# Altium schematic sheet P02_MCU.SchDoc
size A4; SheetNumber: 2; SheetTotal: 3
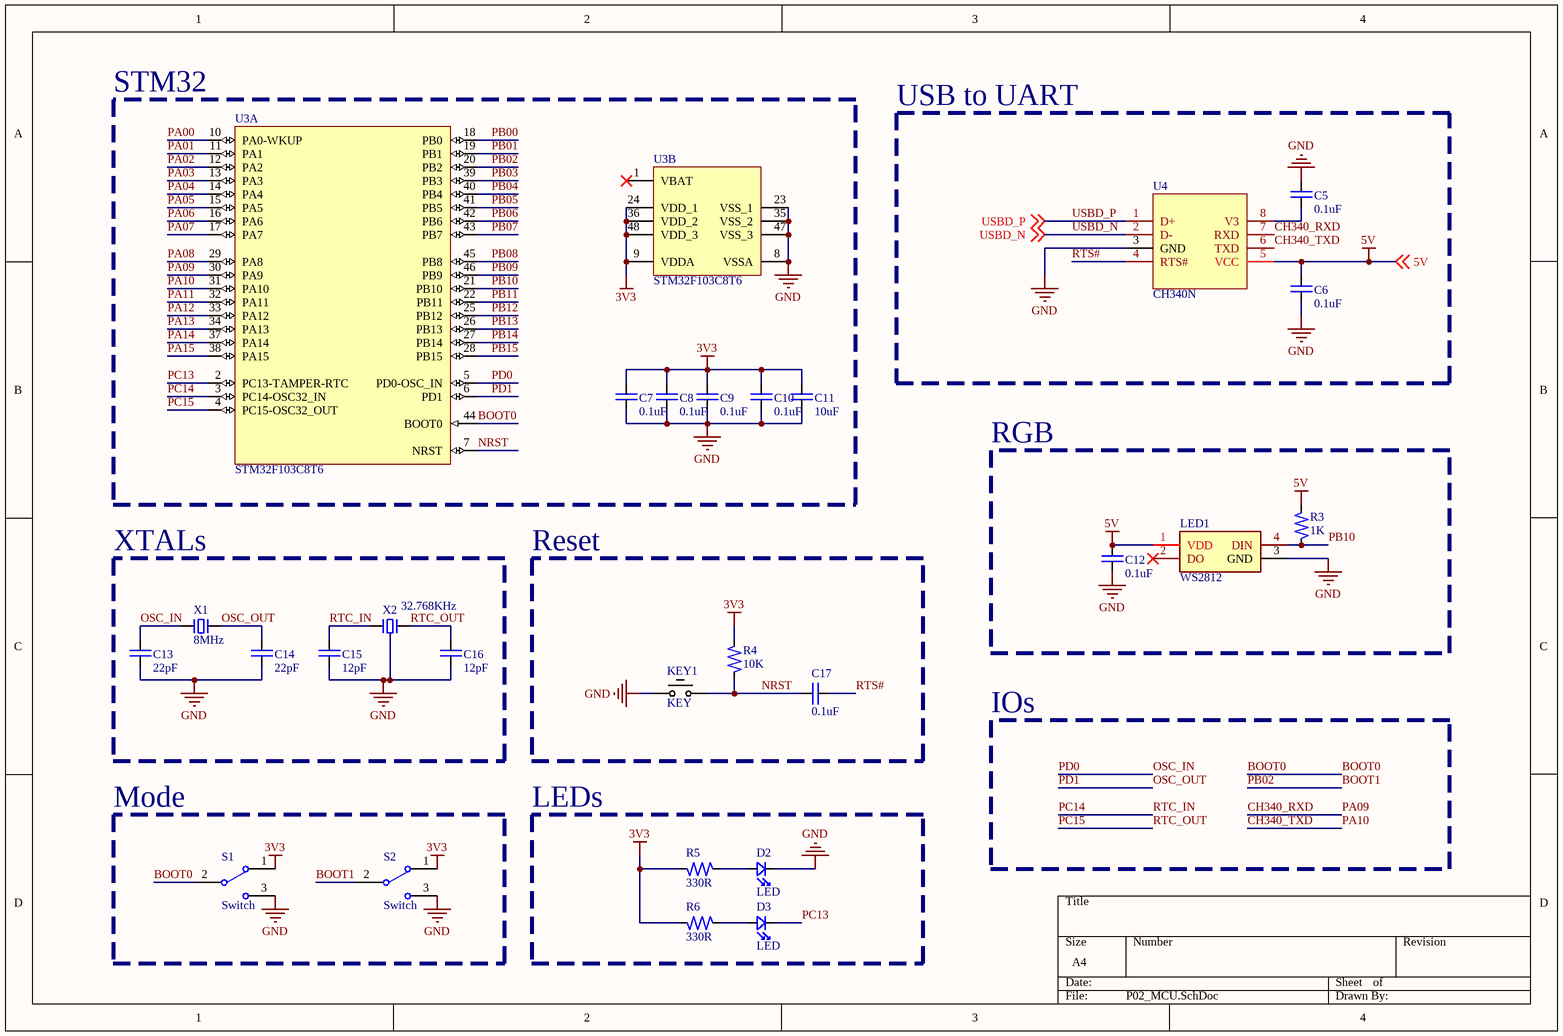
[diagram p0: P02_MCU.SchDoc]

## Parts
C5  0.1uF  [C_0603]
C6  0.1uF  [C_0603]
C7  0.1uF  [C_0603]
C8  0.1uF  [C_0603]
C9  0.1uF  [C_0603]
C10  0.1uF  [C_0603]
C11  10uF  [C_0603]
C12  0.1uF  [C_0603]
C13  22pF  [C_0603]
C14  22pF  [C_0603]
C15  12pF  [C_0603]
C16  12pF  [C_0603]
C17  0.1uF  [C_0603]
D2  LED  [LED_0603]
D3  LED  [LED_0603]
KEY1  KEY  [KEY]
LED1  WS2812  [SMD5050]
R3  1K  [R_0603]
R4  10K  [R_0603]
R5  330R  [R_0603]
R6  330R  [R_0603]
S1  Switch  [Sliding Switch_3P]
S2  Switch  [Sliding Switch_3P]
U3  STM32F103C8T6  [QFP-48]  (parts A,B of 2)
U4  CH340N  [SOP-8]
X1  8MHz  [XTAL_HC49S]
X2  32.768KHz  [XTAL_DT26]

## Blocks framed on the sheet
STM32: C7-C11 U3
USB to UART: C5 C6 U4
RGB: C12 LED1 R3
XTALs: C13-C16 X1 X2
Reset: C17 KEY1 R4
Mode: S1 S2
LEDs: D2 D3 R5 R6

## Nets
3V3: C7.1 C8.2 C9.2 C10.2 C11.2 R4.1 R5.1 R6.1 S1.1 S2.1 U3.9(VDDA) U3.24(VDD_1) U3.36(VDD_2) U3.48(VDD_3)
5V: C6.1 C12.1 LED1.1(VDD) R3.2 U4.5(VCC) ; off-sheet 5V
GND: C5.1 C6.2 C7.2 C8.1 C9.1 C10.1 C11.1 C12.2 C13.2 C14.2 C15.2 C16.2 D2.1 KEY1.2 LED1.3(GND) S1.3 S2.3 U3.8(VSSA) U3.23(VSS_1) U3.35(VSS_2) U3.47(VSS_3) U4.3(GND) X2.0
BOOT0: S1.2 U3.44(BOOT0)
BOOT1: S2.2 U3.20(PB2)  [also labelled PB02]
CH340_RXD: U3.30(PA9) U4.7(RXD)  [also labelled PA09]
CH340_TXD: U3.31(PA10) U4.6(TXD)  [also labelled PA10]
NRST: C17.1 KEY1.1 R4.2 U3.7(NRST)
OSC_IN: C13.1 U3.5(PD0-OSC_IN) X1.1  [also labelled PD0]
OSC_OUT: C14.1 U3.6(PD1) X1.2  [also labelled PD1]
PA00: U3.10(PA0-WKUP)
PA01: U3.11(PA1)
PA02: U3.12(PA2)
PA03: U3.13(PA3)
PA04: U3.14(PA4)
PA05: U3.15(PA5)
PA06: U3.16(PA6)
PA07: U3.17(PA7)
PA08: U3.29(PA8)
PA11: U3.32(PA11)
PA12: U3.33(PA12)
PA13: U3.34(PA13)
PA14: U3.37(PA14)
PA15: U3.38(PA15)
PB00: U3.18(PB0)
PB01: U3.19(PB1)
PB03: U3.39(PB3)
PB04: U3.40(PB4)
PB05: U3.41(PB5)
PB06: U3.42(PB6)
PB07: U3.43(PB7)
PB08: U3.45(PB8)
PB09: U3.46(PB9)
PB10: LED1.4(DIN) R3.1 U3.21(PB10)
PB11: U3.22(PB11)
PB12: U3.25(PB12)
PB13: U3.26(PB13)
PB14: U3.27(PB14)
PB15: U3.28(PB15)
PC13: D3.1 U3.2(PC13-TAMPER-RTC)
PC14: C15.1 U3.3(PC14-OSC32_IN) X2.1  [also labelled RTC_IN]
PC15: C16.1 U3.4(PC15-OSC32_OUT) X2.2  [also labelled RTC_OUT]
RTS#: C17.2 U4.4(RTS#)
USBD_N: U4.2(D-) ; off-sheet USBD_N
USBD_P: U4.1(D+) ; off-sheet USBD_P
NetC5_2: C5.2 U4.8(V3)
NetD2_2: D2.2 R5.2
NetD3_2: D3.2 R6.2

Not connected (* = marked no-connect by the designer): LED1 2(DO)*; U3 1(VBAT)*

## Notes on the sheet
- IOs

## Library data of the parts
C5-C17 = C: 无极性电容
D2 D3 = LED: Diode
KEY1 = KEY: 通用2脚按键
R3-R6 = R: Resistor
U3 = STM32F103C8T6: STM32 ARM-based 32-bit MCU Performance Line with 64 kB Flash, 20 kB Internal RAM, -40 to +85 Temperature, 48-Pin LQFP, Tray; ComponentLink1Description: Manufacturer URL; ComponentLink1URL: http://www.st.com/; ComponentLink2Description: STM32F103 Datasheet; ComponentLink2URL: http://www.st.com/internet/com/TECHNICAL_RESOURCES/TECHNICAL_LITERATURE/DATASHEET/CD00161566.pdf; ComponentLink3Description: STM32 Family Web Page; ComponentLink3URL: www.st.com/stm32; PackageReference: LQFP48; PackageDescription: 48-Pin Low-Profile Quad Flat Pack, 7 x 7 mm Body, 0.5 mm Pitch (LQFP48)
U4 = CH340N: USB转UART
X1 = XTAL: 晶振
X2 = XTAL_RTC: 晶振